# Altium schematic sheet Power.SchDoc
size A4
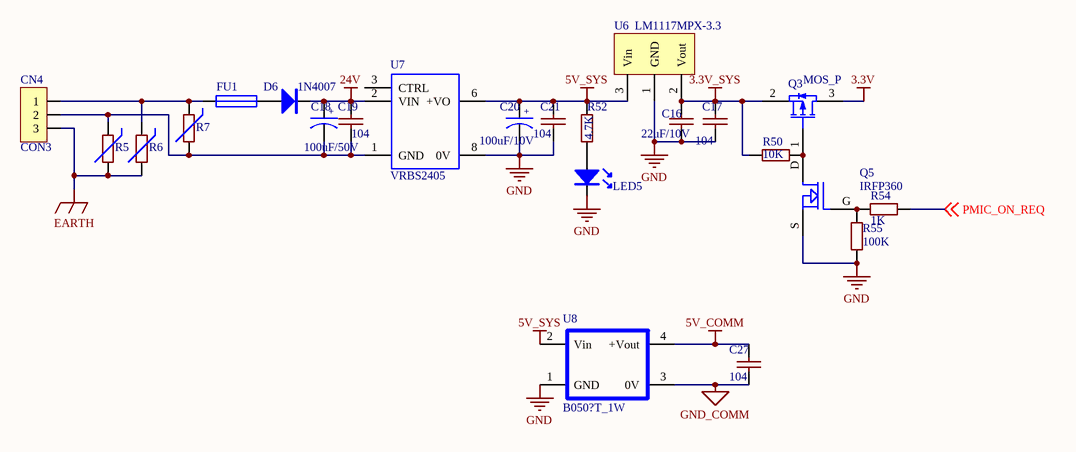
[diagram p0: Power.SchDoc]

## Parts
C16  22uF/10V  [0805SMD_Cap]
C17  104  [0805SMD_Cap]
C18  100uF/50V  [电解电容-10]
C19  104  [0805SMD_Cap]
C20  100uF/10V  [电解电容-10]
C21  104  [0805SMD_Cap]
C27  104  [0805SMD_Cap]
CN4  CON3  [WJ15EDGRM-3.81-3P-14-00A]
D6  1N4007  [二极管SMA]
FU1  FUSE1  [RAD0.2]  (value not drawn)
LED5  LED  [发光二极管0805]  (value not drawn)
Q3  MOS_P  [SOT-23]
Q5  IRFP360  [SOT-23 - MOS]
R5  10d330K  [RAD0.2]  (value not drawn)
R6  10d330K  [RAD0.2]  (value not drawn)
R7  10d330K  [RAD0.2]  (value not drawn)
R50  10K  [0805_SMD_R]
R52  4.7K  [0805_SMD_R]
R54  1K  [0805_SMD_R]
R55  100K  [0805_SMD_R]
U6  LM1117MPX-3.3  [SOT-223]
U7  VRBS2405  [VRB_S]
U8  B050?T_1W  [B0505S_1W]

## Nets
3.3V: Q3.3(D)
3.3V_SYS: C16.1 C17.1 Q3.2(S) R50.2 U6.2(Vout)
5V_COMM: C27.1 U8.4(+Vout)
5V_SYS: C20.1 C21.1 R52.2 U6.3(Vin) U7.6(+VO) U8.2(Vin)
24V: C18.1 C19.1 D6.K U7.2(VIN)
EARTH: CN4.3 R5.1 R6.1
GND: C16.2 C17.2 C20.2 C21.2 LED5.K Q5.S(SOURCE) R55.2 U6.1(GND) U7.8(0V) U8.1(GND)
GND_COMM: C27.2 U8.3(0V)
PMIC_ON_REQ: R54.1 ; off-sheet PMIC_ON_REQ
NetC18_2: C18.2 C19.2 CN4.2 R5.2 R7.1 U7.1(GND)
NetCN4_1: CN4.1 FU1.1 R6.2 R7.2
NetD6_A: D6.A FU1.2
NetLED5_A: LED5.A R52.1
NetQ3_1: Q3.1(G) Q5.D(DRAIN) R50.1
NetQ5_G: Q5.G(GATE) R54.2 R55.1

Not connected (* = marked no-connect by the designer): U7 3(CTRL) 5(NC) 7(NC)

## Notes on the sheet
- (in symbol CAP  POL) +

## Library data of the parts
C16 = SMD_Cap: 贴片电容; 研究所: 贴装电容_0805_4700pF; 松下: GR21BB1H472K
C17 C19 C21 C27 = SMD_Cap: 贴片电容; 研究所: 贴装电容_0805_0.1uF; 松下: GR21BB1H104K; 松下: GR21BB1H224K; 松下: GR21BB1H103K; 研究所: 贴装电容_0805_0.22uF; 研究所: 贴装电容_0805_0.01uF; 松下: GR21BB1H473K; 研究所: 贴装电容_0805_0.047uF; 松下: GR21BB1H300K; 研究所: 贴装电容_0805_30pF; 松下: GR21BB1H105K; 研究所: 贴装电容_0805_1uF; 松下: GR21BB1H472K; 研究所: 贴装电容_0805_4700pF
C18 C20 = CAP  POL: 电解电容; Value: R1HCX010MT50
CN4 = CON3: 连接器; 松下: B3PVHB
D6 = DIODE: 二极管
FU1 = FUSE1: 保险
LED5 = LED: 发光二极管
Q5 = MOSFET N: MOS管
R5-R7 = 压敏电阻: 松下: RS05K101FT; 松下: RS05000FT; 松下: RS05K3321FT; 松下: RS05K6811FT; 松下: RS05K102FT; 松下: RS05K2211FT; 松下: RS05K103FT; 松下: RS05K5111FT; 松下: RS05K5110FT; 松下: RS05K5112FT; 松下: RS05K8251FT; 松下: RS05K2212FT; 松下: RS05K104FT; 松下: RS05K5113FT; 松下: RS05K105FT; 松下: RS05L106FT; 研究所: 贴装电阻_0805_0_F1%; 研究所: 贴装电阻_0805_100_F1%; 研究所: 贴装电阻_0805_51.1K_F1%; 研究所: 贴装电阻_0805_1K_F1%; 研究所: 贴装电阻_0805_2.21K_F1%; 研究所: 贴装电阻_0805_3.32K_F1%; 研究所: 贴装电阻_0805_5.11K_F1%; 研究所: 贴装电阻_0805_511K_F1%; 研究所: 贴装电阻_0805_6.81K_F1%; 研究所: 贴装电阻_0805_511_F1%; 研究所: 贴装电阻_0805_8.25K_F1%; 研究所: 贴装电阻_0805_10K_F1%; 研究所: 贴装电阻_0805_22.1K_F1%; 研究所: 贴装电阻_0805_100K_F1%; 研究所: 贴装电阻_0805_1M_F1%; 研究所: 贴装电阻_0805_10M_F1%
R50 R52 R54 R55 = SMD_0805: 贴片电阻; 松下: RS05K101FT; 松下: RS05000FT; 松下: RS05K3321FT; 松下: RS05K6811FT; 松下: RS05K102FT; 松下: RS05K2211FT; 松下: RS05K103FT; 松下: RS05K5111FT; 松下: RS05K5110FT; 松下: RS05K5112FT; 松下: RS05K8251FT; 松下: RS05K2212FT; 松下: RS05K104FT; 松下: RS05K5113FT; 松下: RS05K105FT; 松下: RS05L106FT; 研究所: 贴装电阻_0805_0_F1%; 研究所: 贴装电阻_0805_100_F1%; 研究所: 贴装电阻_0805_51.1K_F1%; 研究所: 贴装电阻_0805_1K_F1%; 研究所: 贴装电阻_0805_2.21K_F1%; 研究所: 贴装电阻_0805_3.32K_F1%; 研究所: 贴装电阻_0805_5.11K_F1%; 研究所: 贴装电阻_0805_511K_F1%; 研究所: 贴装电阻_0805_6.81K_F1%; 研究所: 贴装电阻_0805_511_F1%; 研究所: 贴装电阻_0805_8.25K_F1%; 研究所: 贴装电阻_0805_10K_F1%; 研究所: 贴装电阻_0805_22.1K_F1%; 研究所: 贴装电阻_0805_100K_F1%; 研究所: 贴装电阻_0805_1M_F1%; 研究所: 贴装电阻_0805_10M_F1%
U6 = LM1117MPX-3.3: LM1117 3.3V固定输出; 编号: B00004; 名称: 贴装芯片_LM1117MPX-3.3
U8 = B0505S_1W